# Altium schematic sheet BeetleMeterV2.SchDoc
size 203 x 127 mm; SheetNumber: 1; SheetTotal: 1
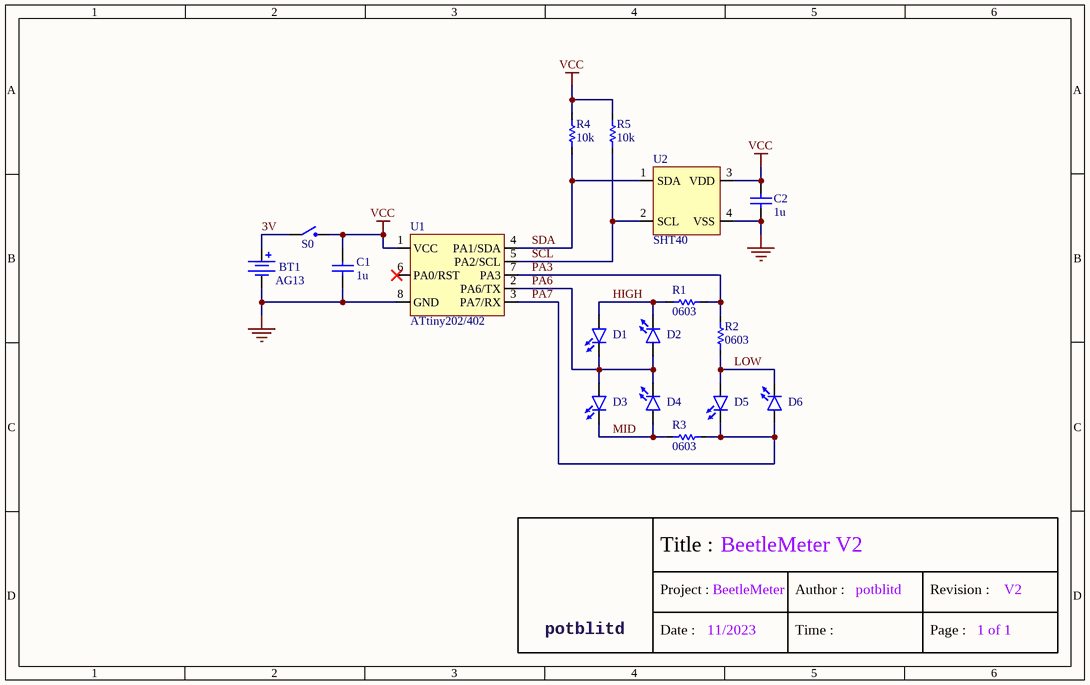
[diagram p0: BeetleMeterV2.SchDoc]

## Parts
BT1  AG13  [AG13]
C1  value 1u  [0603C]  (hidden comment: Capacitor)
C2  value 1u  [0603C]  (hidden comment: Capacitor)
D1  LED  [0603D]  (value not drawn)
D2  LED  [0603D]  (value not drawn)
D3  LED  [0603D]  (value not drawn)
D4  LED  [0603D]  (value not drawn)
D5  LED  [0603D]  (value not drawn)
D6  LED  [0603D]  (value not drawn)
R1  value 0603  [0603R]  (hidden comment: Resistor)
R2  value 0603  [0603R]  (hidden comment: Resistor)
R3  value 0603  [0603R]  (hidden comment: Resistor)
R4  value 10k  [0603R]  (hidden comment: Resistor)
R5  value 10k  [0603R]  (hidden comment: Resistor)
S0  Switch  [SW_4.5*4.5]  (value not drawn)
U1  ATtiny202/402  [SOP-8]
U2  SHT40  [DFN-4-EP(1.5x1.5)]

## Nets
GND: BT1.2(-) C1.1 C2.2 U1.8(GND) U2.4(VSS)
VCC: C1.2 C2.1 R4.2 R5.2 S0.2 U1.1(VCC) U2.3(VDD)
3V: BT1.1(+) S0.1
HIGH: D1.1 D2.2 R1.1
LOW: D5.1 D6.2 R2.1
MID: D3.2 D4.1 R3.2
PA3: R1.2 R2.2 U1.7(PA3)
PA6: D1.2 D2.1 D3.1 D4.2 U1.2(PA6/TX)
PA7: D5.2 D6.1 R3.1 U1.3(PA7/RX)
SCL: R5.1 U1.5(PA2/SCL) U2.2(SCL)
SDA: R4.1 U1.4(PA1/SDA) U2.1(SDA)

Not connected (* = marked no-connect by the designer): U1 6(PA0/RST)*

## Notes on the sheet
- Title :
- BeetleMeter V2
- potblitd
- Project :
- Date :
- 11/2023
- BeetleMeter
- Author :
- Time :
- Revision :
- Page :
- 1 of 1
- V2

## Library data of the parts
BT1 = Battery 3V: Coin cell battery 3V; Value: 2*LR44
C1 C2 = Capacitor: Capacitor 1uF
  C1: Value: 1uF
D1-D6 = LED: General LED symbol
R1-R5 = RES
S0 = Switch-2: 2-positions switch open-closed; Value: 6*6
U1 = ATtiny202/402: tiny AVR 8-pin microcontroller; Value: ATtiny402
U2 = SHT40: SHT40 temperature and humidity sensor; Value: SHT40